# EAGLE design L293_sparse (EAGLE 5.08)
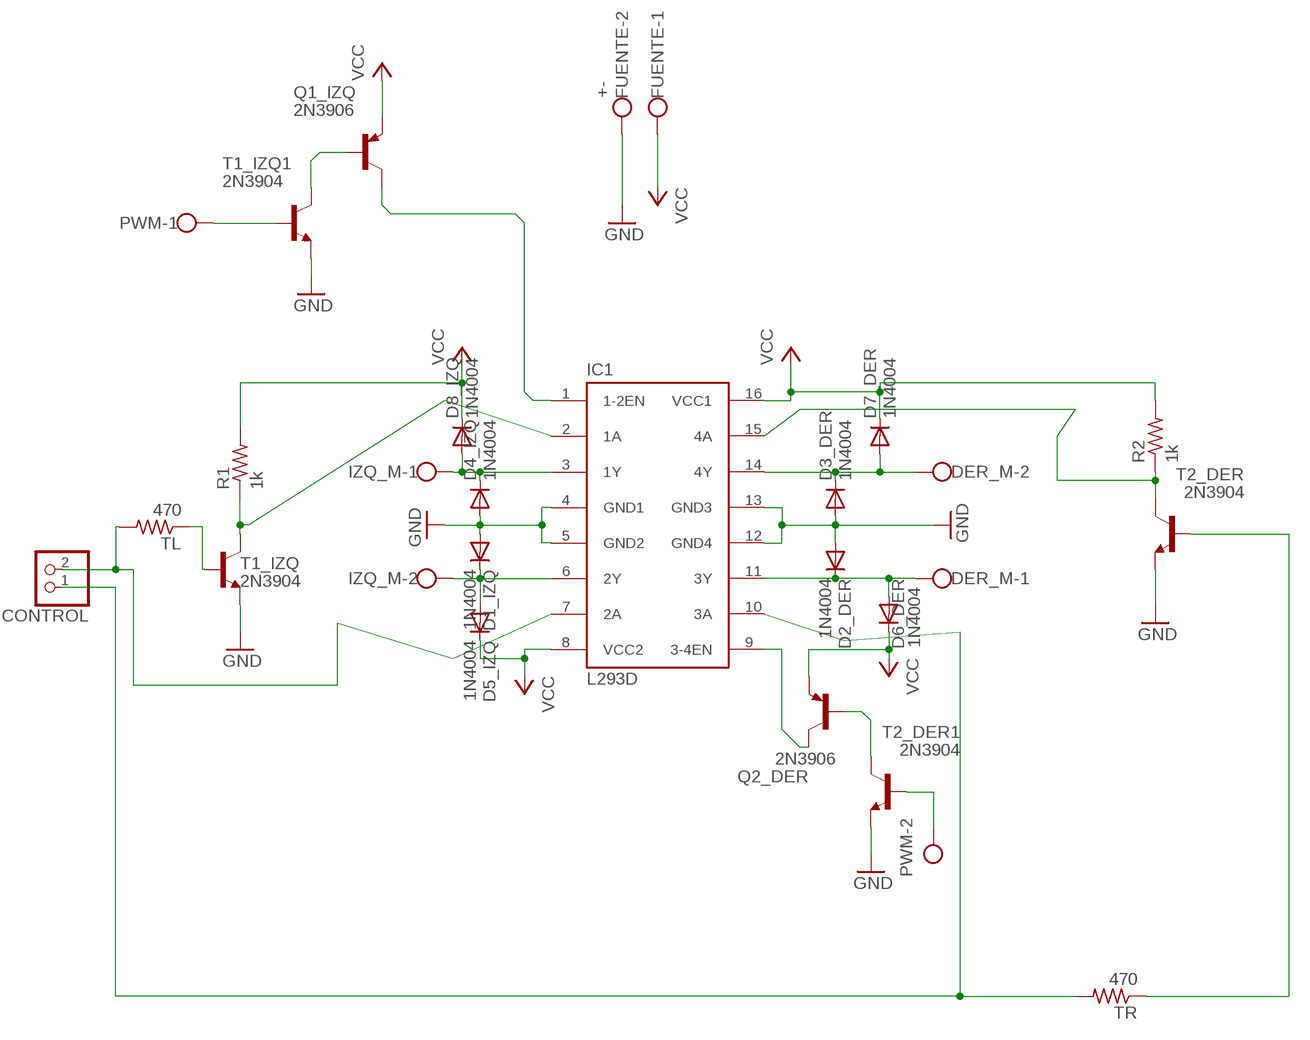
[diagram p0: schematic, sheet 1]

## Parts
CONTROL  PINHD-1X2/90  [1X02/90]
D1_IZQ  1N4004  [DO41-10]
D2_DER  1N4004  [DO41-10]
D3_DER  1N4004  [DO41-10]
D4_IZQ  1N4004  [DO41-10]
D5_IZQ  1N4004  [DO41-10]
D6_DER  1N4004  [DO41-10]
D7_DER  1N4004  [DO41-10]
D8_IZQ  1N4004  [DO41-10]
DER_M  W237-02P  [W237-132]
FUENTE  +-  W237-02P  [W237-132]
IC1  L293D  [DIL16]
IZQ_M  W237-02P  [W237-132]
PWM  W237-02P  [W237-132]
Q1_IZQ  2N3906  [TO92]
Q2_DER  2N3906  [TO92]
R1  1k  R-US_0207/12  [0207/12]
R2  1k  R-US_0207/12  [0207/12]
T1_IZQ  2N3904  [TO92]
T1_IZQ1  2N3904  [TO92]
T2_DER  2N3904  [TO92]
T2_DER1  2N3904  [TO92]
TL  470  R-US_0207/12  [0207/12]
TR  470  R-US_0207/12  [0207/12]

## Nets
GND: D1_IZQ.A D2_DER.A D3_DER.A D4_IZQ.A FUENTE.2 IC1.4(GND1) IC1.5(GND2) IC1.12(GND4) IC1.13(GND3) T1_IZQ1.3(E) T1_IZQ.3(E) T2_DER1.3(E) T2_DER.3(E)
N$1: D2_DER.C D6_DER.A DER_M.1 IC1.11(3Y)
N$2: D3_DER.C D7_DER.A DER_M.2 IC1.14(4Y)
N$3: D1_IZQ.C D5_IZQ.A IC1.6(2Y) IZQ_M.2
N$4: D4_IZQ.C D8_IZQ.A IC1.3(1Y) IZQ_M.1
N$5: CONTROL.2 IC1.7(2A) TL.2
N$6: T1_IZQ.2(B) TL.1
N$7: IC1.2(1A) R1.1 T1_IZQ.1(C)
N$8: T2_DER.2(B) TR.1
N$9: IC1.15(4A) R2.1 T2_DER.1(C)
N$10: Q1_IZQ.2(B) T1_IZQ1.1(C)
N$11: IC1.1(1-2EN) Q1_IZQ.1(C)
N$12: CONTROL.1 IC1.10(3A) TR.2
N$13: PWM.1 T1_IZQ1.2(B)
N$14: Q2_DER.2(B) T2_DER1.1(C)
N$15: PWM.2 T2_DER1.2(B)
N$17: IC1.9(3-4EN) Q2_DER.1(C)
VCC: D5_IZQ.C D6_DER.C D7_DER.C D8_IZQ.C FUENTE.1 IC1.8(VCC2) IC1.16(VCC1) Q1_IZQ.3(E) Q2_DER.3(E) R1.2 R2.2

## Library data of the parts
CONTROL = pinhead:PINHD-1X2: PIN HEADER
D1_IZQ D2_DER D3_DER D4_IZQ D5_IZQ D6_DER D7_DER D8_IZQ = diode:1N4004: DIODE general purpose rectifier, 1 A
DER_M FUENTE IZQ_M PWM = con-wago-508:W237-02P: WAGO SREW CLAMP
IC1 = st-microelectronics:L293D: PUSH-PULL 4 CHANNEL DRIVER
Q1_IZQ Q2_DER = transistor-pnp:2N3906: PNP Transistor
R1 R2 TL TR = rcl:R-US_: RESISTOR, American symbol
T1_IZQ T1_IZQ1 T2_DER T2_DER1 = transistor:2N3904: NPN TRANSISTOR

## Board
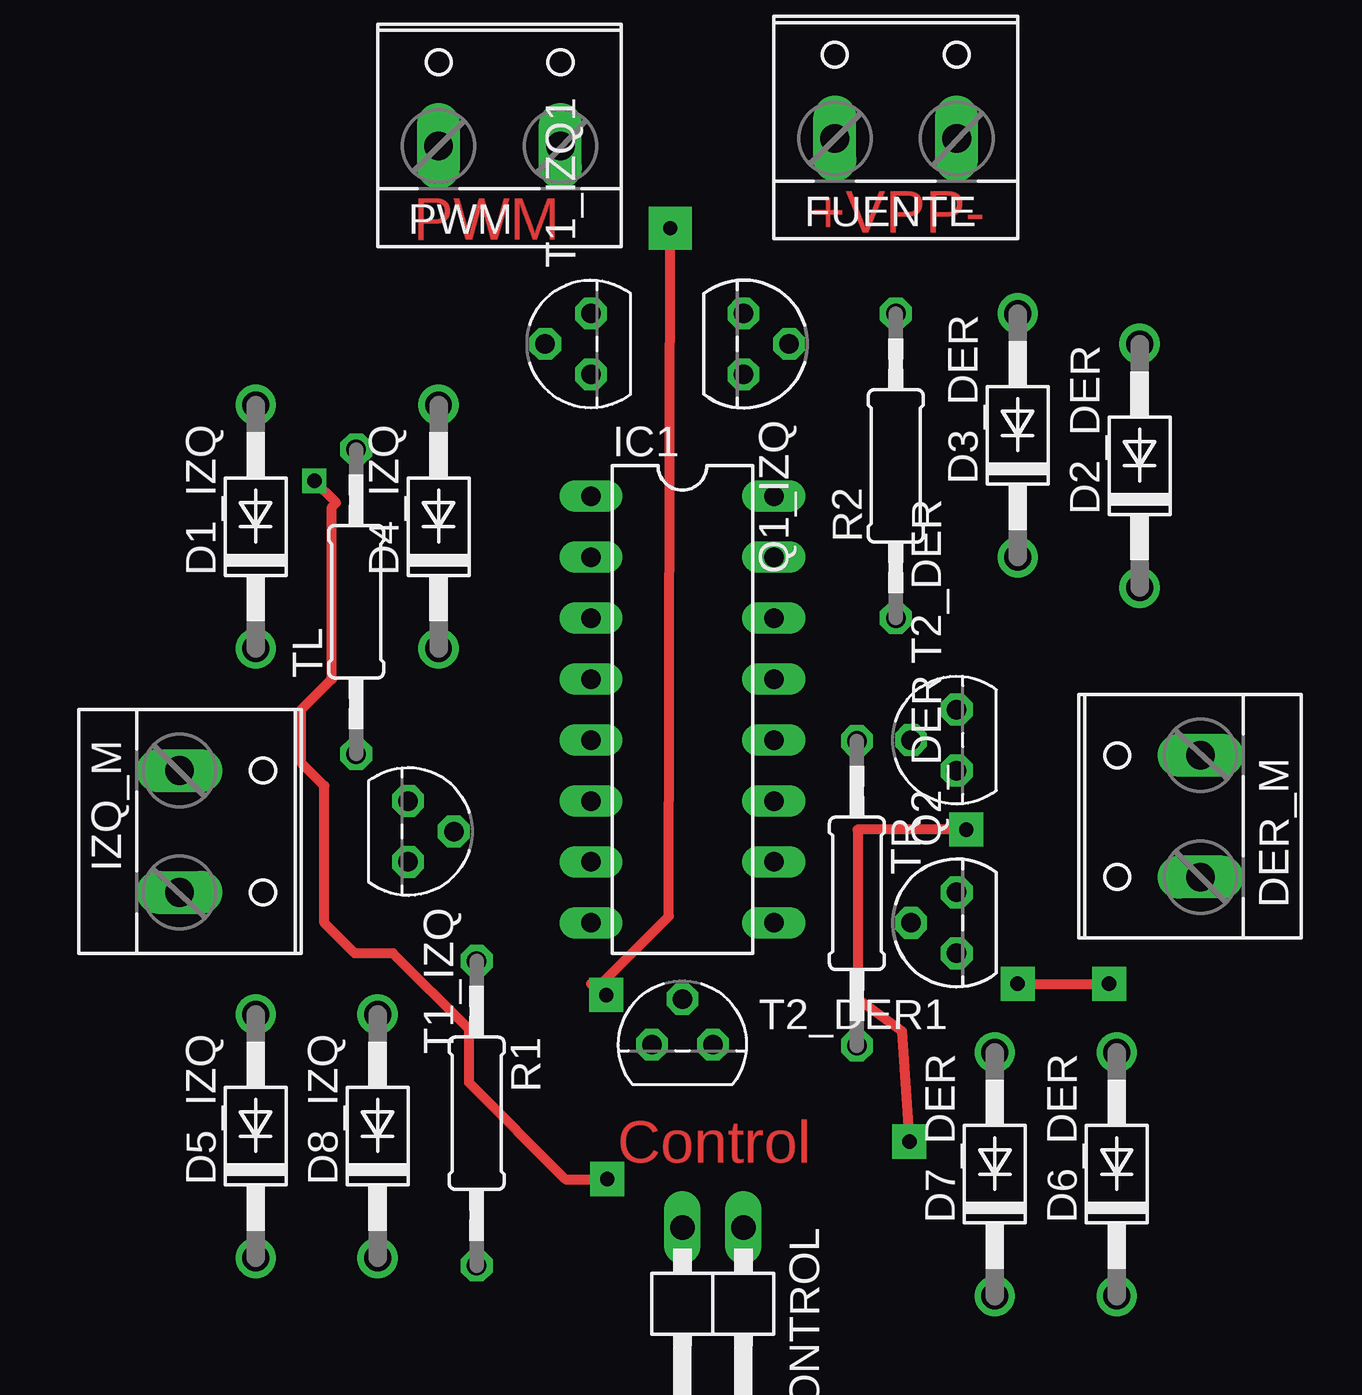
[diagram p1: board, top side]
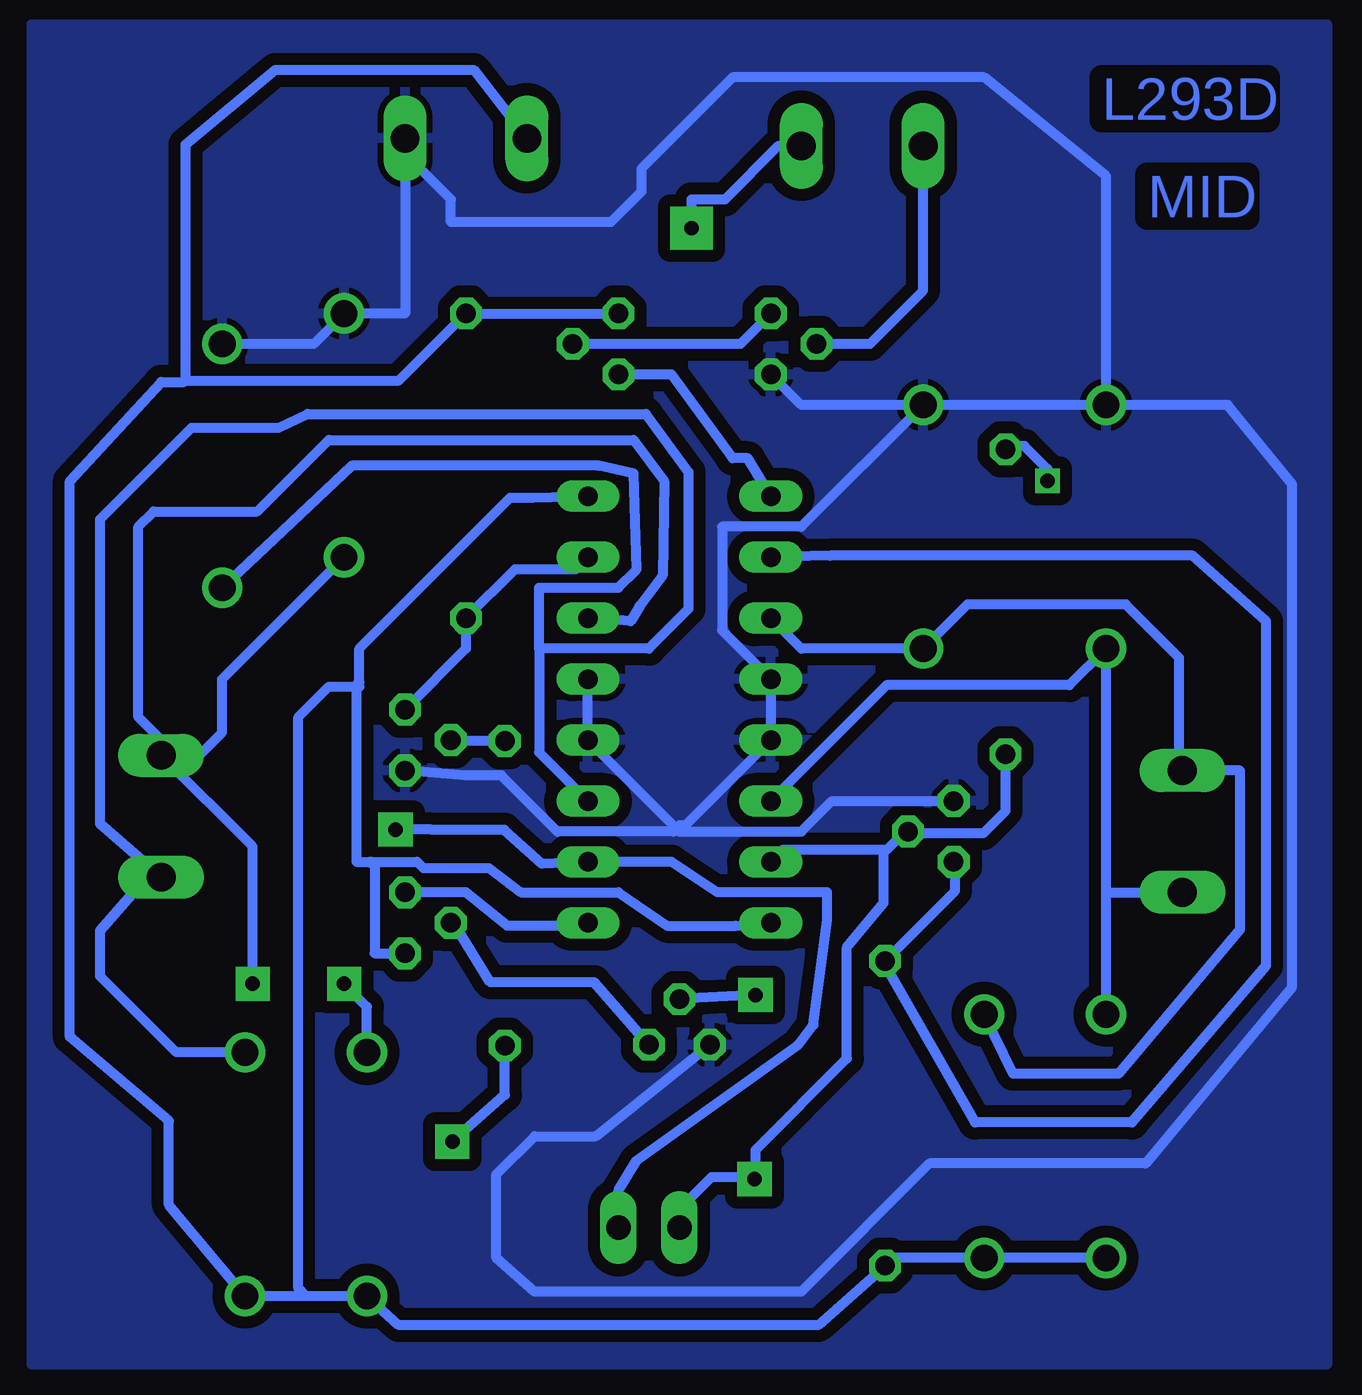
[diagram p2: board, bottom side, seen from below]

No outline drawn. Coordinates in mm, seen from the top.
Copper layers (1*16): Top 0.035mm / dielectric 1.5mm / Bottom 0.035mm
Design rules "default *": minimum track width 16mil, minimum drill 24mil, track to track 20mil, track to pad 20mil, pad to pad 20mil, via to via 12mil, smd to smd 8mil, copper to edge 40mil, drill to drill 8mil, minimum pad ring 10mil, minimum via ring 8mil, stop-mask expansion 4mil, vias tented up to drill 0mil, thermal gap 10mil

### Footprints (pad centres in the part's own frame; a part is rotated, then mirrored left to right if it is on the bottom)
1X02/90 = drill 1.016 long: 1 -1.27,-3.81; 2 1.27,-3.81
DO41-10 = drill 1.118 round: A 5.08,0; C -5.08,0
W237-132 = drill 1.194 long: 1 -2.54,-0.635; 2 2.54,-0.635
DIL16 = drill 0.813 long: 1 -8.89,-3.81; 2 -6.35,-3.81; 3 -3.81,-3.81; 4 -1.27,-3.81; 5 1.27,-3.81; 6 3.81,-3.81; 7 6.35,-3.81; 8 8.89,-3.81; 9 8.89,3.81; 10 6.35,3.81; 11 3.81,3.81; 12 1.27,3.81; 13 -1.27,3.81; 14 -3.81,3.81; 15 -6.35,3.81; 16 -8.89,3.81
TO92 = drill 0.813 octagon: 1 1.27,0; 2 0,1.905; 3 -1.27,0
0207/12 = drill 0.813 octagon: 1 -6.35,0; 2 6.35,0

### Placement (x,y rotation side)
CONTROL  45.72,3.81 180 top
D1_IZQ  26.67,36.83 90 top
D2_DER  63.5,39.37 90 top
D3_DER  58.42,40.64 90 top
D4_IZQ  34.29,36.83 90 top
D5_IZQ  26.67,11.43 90 top
D6_DER  62.55,9.84 90 top
D7_DER  57.47,9.84 90 top
D8_IZQ  31.75,11.43 90 top
DER_M  65.41,24.77 90 top
FUENTE  53.34,53.66 0 top
IC1  44.45,29.21 270 top
IZQ_M  24.13,24.13 270 top
PWM  36.83,53.34 0 top
Q1_IZQ  46.99,44.45 270 top
Q2_DER  55.88,20.32 90 top
R1  35.88,12.38 270 top
R2  53.34,39.37 90 top
T1_IZQ  33.02,24.13 270 top
T1_IZQ1  40.64,44.45 90 top
T2_DER  55.88,27.94 90 top
T2_DER1  44.45,15.24 0 top
TL  30.86,33.71 90 top
TR  51.72,21.55 270 top

### Tracks (layer width: path | path; a pad name or v marks a point on that pad's centre or on a via)
GND
  Bottom 0.406: T1_IZQ.3 38.1,25.4 39.37,24.13 44.45,24.13 44.58,24.26 | 44.58,24.26 IC1.12 IC1.13 | T2_DER.3 53.37,26.47 51.87,26.47 49.53,24.13 44.7,24.13 44.58,24.26 | 44.58,24.26 44.45,24.38 44.2,24.38 IC1.5 IC1.4 42.67,32.51 42.67,36.83 39.37,36.83 D4_IZQ.A | D2_DER.A 59.69,44.45 D3_DER.A 55.88,45.72 55.88,52.39 | T1_IZQ1.3 39.37,41.91 D4_IZQ.A | T2_DER1.3 47.94,11.43 50.48,11.43 52.07,9.84 52.07,6.35 50.48,4.95 39.37,4.95 34.04,10.29 25.02,10.29 18.92,17.65 18.92,38.61 21.59,41.91 D1_IZQ.A | D1_IZQ.A D4_IZQ.A | D1_IZQ.A 26.67,51.44 31.75,55.56 42.23,55.56 46.04,51.75 46.04,50.8 47.31,49.53 53.98,49.53 53.98,50.48 55.88,52.39 | 55.88,52.39 FUENTE.2
  pour Bottom: 40.39,30.73 48.26,30.73 48.26,30.23 48.26,27.69 48.01,27.69 44.96,24.64 43.94,24.64 41.15,27.43 40.64,27.94 40.64,30.23 40.13,30.73
  pour Bottom: 71.44,1.91 71.44,57.78 17.46,57.78 17.46,1.91
N$1
  Bottom 0.406: IC1.11 50.29,27.43 50.29,31.75 | 50.29,31.75 50.29,34.29 46.99,34.29 46.23,35.05 46.35,39.05 47.82,39.37 58.1,39.37 D2_DER.C | 50.29,31.75 45.72,31.75 44.07,33.4 44.07,39.12 45.85,41.53 59.94,41.53 61.15,40.96 64.77,40.96 68.58,37.15 68.58,24.45 DER_M.1 66.36,22.54 68.58,20 68.58,18.1 65.41,14.92 D6_DER.A
N$2  (via drill 0.6 pad 1.42)
  Top 0.406: v58.42,17.78 v62.23,17.78
  Bottom 0.406: IC1.14 46.48,32.89 46.1,33.53 45.15,34.8 45.09,38.73 46.35,40.45 59.05,40.45 62.04,37.47 66.36,37.47 66.99,36.83 66.99,28.89 66.04,27.94 DER_M.2 | 61.21,32.77 D3_DER.C 63.5,30.48 63.5,28.26 64.45,27.3 DER_M.2 | D7_DER.A 57.47,16.83 v58.42,17.78 | 61.91,18.1 v62.23,17.78 62.23,23.5 DER_M.2
N$3
  Bottom 0.406: D5_IZQ.A 26.67,21.59 | 26.67,21.59 IZQ_M.2 | IC1.6 35.81,30.23 28.19,30.23 D1_IZQ.C 26.67,21.59
N$4
  Bottom 0.406: IC1.3 39.37,31.75 D4_IZQ.C 32.45,33.59 25.84,33.59 23.62,31.37 23.62,26.67 IZQ_M.1 21.08,26.67 21.08,20.07 26.16,14.03 30.54,14.03 D8_IZQ.A
N$5  (via drill 0.6, 0.6 pad 1.42)
  Top 0.406: v29.11,38.74 30.02,37.83 29.84,37.65 29.84,30.48 28.57,29.21 28.57,26.99 29.53,26.04 29.53,20.32 30.8,19.05 32.38,19.05 35.56,15.88 35.56,13.65 39.58,9.64 v41.32,9.64
  Bottom 0.406: IC1.7 40.13,23.37 35.94,23.37 | 35.94,23.37 35.81,23.37 35.05,24.13 | 35.94,23.37 35.94,21.14 37.47,19.3 37.47,14.67 41.27,10.86 41.27,9.68 v41.32,9.64 41.4,9.71 43.12,9.71 44.45,8.38 CONTROL.2 | v29.11,38.74 29.11,39.24 30.07,40.2 30.72,40.2 TL.2
N$6
  Bottom 0.406: TL.1 30.86,24.99 31.79,24.05 34.85,24.05 T1_IZQ.2
N$7
  Bottom 0.406: T1_IZQ.1 32.96,22.86 32.96,21.65 R1.1 35.94,18.67 32.13,12 25.59,12 20,18.54 20,32.89 23.05,35.62 38.16,35.62 IC1.2
N$8
  Bottom 0.406: TR.1 53.98,27.9 T2_DER.2
N$9
  Bottom 0.406: IC1.15 48.77,35.05 51.31,35.05 R2.1 53.34,31.75 T2_DER.1
N$10
  Bottom 0.406: T1_IZQ1.1 41.91,44.45 Q1_IZQ.2
N$11
  Bottom 0.406: IC1.1 41.59,39.69 42.23,39.69 44.77,43.18 Q1_IZQ.1
N$12  (via drill 0.6 pad 1.42)
  Top 0.406: v53.91,11.21 53.59,15.81 51.75,17.14 51.75,24.21 v56.28,24.21
  Bottom 0.406: CONTROL.1 46.99,9.14 46.23,10.41 39.5,15.24 38.86,16.07 38.29,20.45 38.29,21.59 42.86,21.59 44.77,22.86 IC1.10 50.17,22.79 51.74,24.19 54.77,24.19 54.78,24.21 v56.28,24.21 | TR.2 51.72,13.15 v53.91,11.21
N$13
  Bottom 0.406: PWM.1 34.29,46.67 36.51,44.45 T1_IZQ1.2
N$14
  Bottom 0.406: T2_DER1.1 48.01,17.84 52.32,17.84 53.85,20.32 Q2_DER.2
N$15  (via drill 0.6 pad 1.42, 0.6 pad 1.78)
  Top 0.406: v41.28,17.31 40.64,17.78 41.08,17.78 43.89,20.59 v43.94,49.28
  Bottom 0.406: v41.28,17.31 T2_DER1.2 | 43.94,49.09 v43.94,49.28 43.94,50.48 42.55,50.48 40.32,52.7 PWM.2
N$17
  Bottom 0.406: IC1.9 49.4,20.19 51.63,20.19 53.34,21.59 Q2_DER.1
VCC
  Bottom 0.406: Q1_IZQ.3 R2.2 56.13,42.93 65.02,42.93 | D5_IZQ.C D8_IZQ.C 35.56,6.35 R1.2 38.67,3.56 56.13,3.56 D7_DER.C 60.01,4.76 | IC1.8 42.1,20.19 44.96,20.19 46.99,21.59 51.05,21.59 52.39,22.61 55.12,22.61 55.37,22.86 57.28,22.86 | 57.34,22.86 57.15,22.73 | 57.15,22.73 57.15,19.05 Q2_DER.3 55.63,19.05 | IC1.16 50.55,38.04 51.5,38.04 57.78,31.75 57.78,30.35 | 57.34,22.86 57.28,22.86 | 57.34,22.86 57.91,22.86 57.91,30.23 57.78,30.35 | 57.15,22.73 57.28,22.86 | 65.02,42.93 65.02,52.77 61.28,55.88 53.02,55.88 FUENTE.1 | 60.01,4.76 D6_DER.C 65.72,8.57 65.72,12.06 69.85,15.56 69.85,38.73 66.04,42.86 65.09,42.86 65.02,42.93 | 57.78,30.35 57.78,30.16 59.05,30.16 60.33,28.89 60.33,5.08 60.01,4.76

### Text on the board
Top: PWM | +VPP- | Control
Bottom: L293D | MID